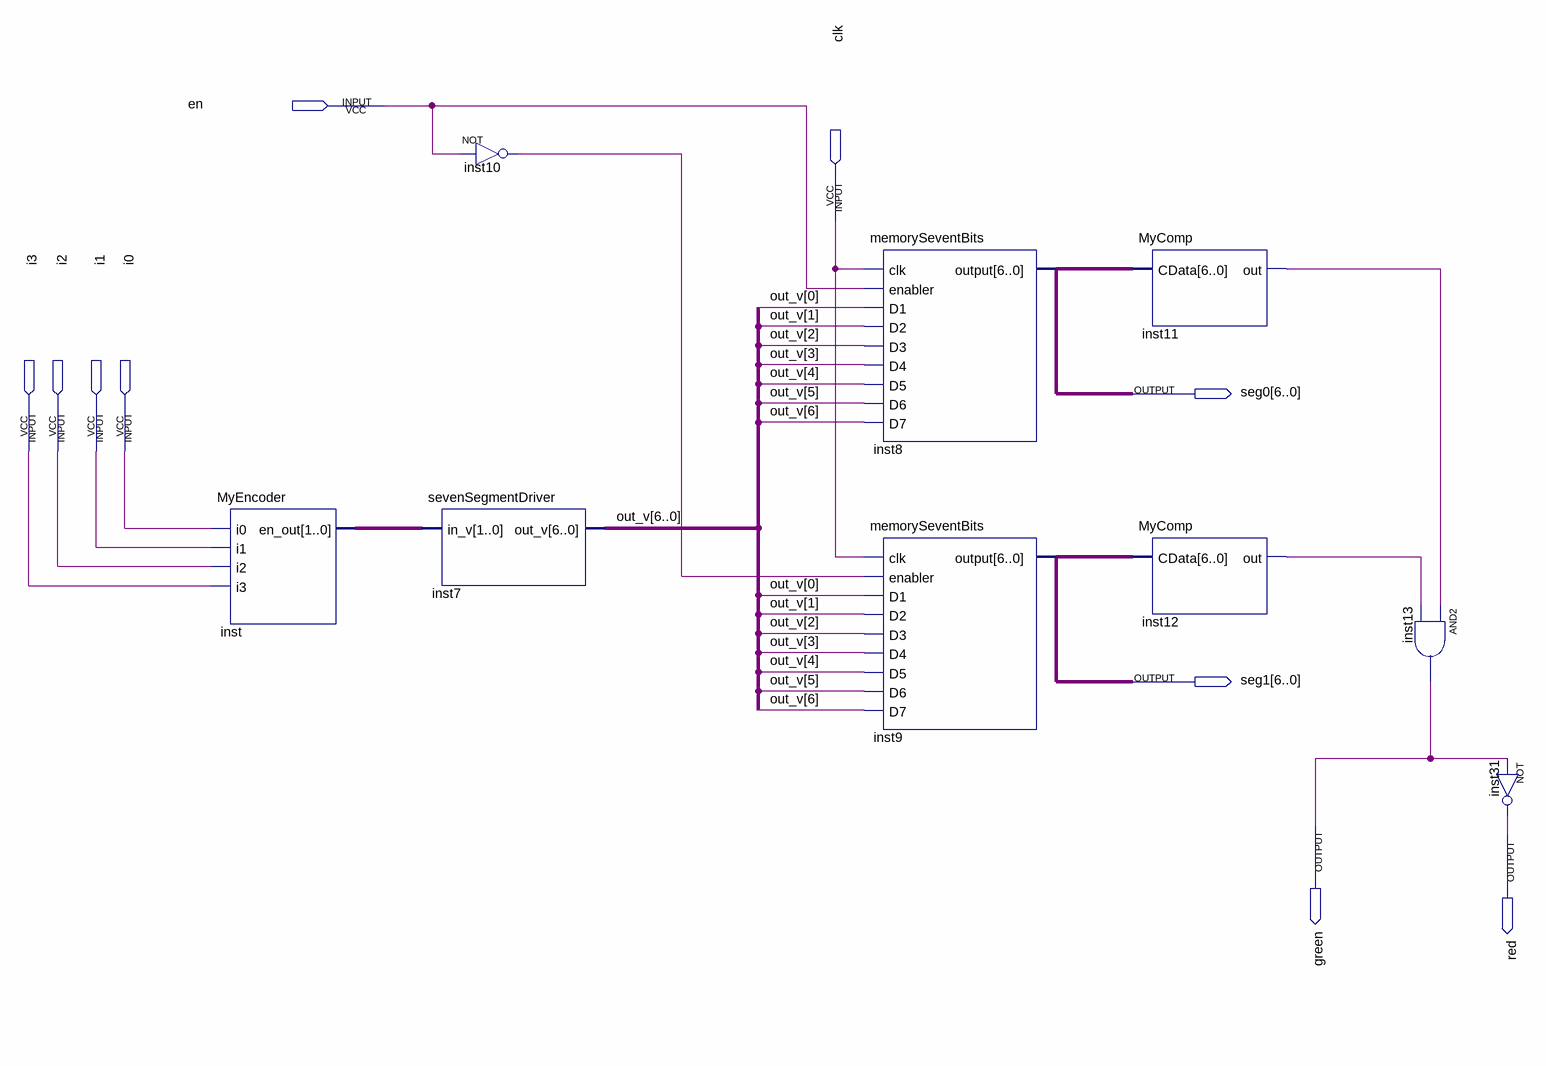
[diagram p0: schematic sheet]
// Quartus schematic finalBlock.bdf as structural Verilog: 9 symbols, 10 pins
module finalBlock (
  input  en,
  input  clk,
  input  i3,
  input  i2,
  input  i1,
  input  i0,
  output [6:0] seg0,
  output [6:0] seg1,
  output green,
  output red
);

  wire inst10_out, inst11_out, inst12_out;
  wire [1:0] inst_en_out;
  wire [6:0] out_v;

  MyEncoder inst (.i0(i0), .i1(i1), .i2(i2), .i3(i3), .en_out(inst_en_out));
  not inst10 (inst10_out, en);
  sevenSegmentDriver inst7 (.in_v(inst_en_out), .out_v(out_v));
  memorySeventBits inst8 (
    .clk(clk), .enabler(en), .D1(out_v[0]), .D2(out_v[1]), .D3(out_v[2]), .D4(out_v[3]), .D5(out_v[4]),
    .D6(out_v[5]), .D7(out_v[6]), .\output (seg0));
  memorySeventBits inst9 (
    .clk(clk), .enabler(inst10_out), .D1(out_v[0]), .D2(out_v[1]), .D3(out_v[2]), .D4(out_v[3]),
    .D5(out_v[4]), .D6(out_v[5]), .D7(out_v[6]), .\output (seg1));
  MyComp inst11 (.CData(seg0), .out(inst11_out));
  MyComp inst12 (.CData(seg1), .out(inst12_out));
  and inst13 (green, inst11_out, inst12_out);
  not inst31 (red, green);
endmodule
